# Altium schematic sheet ESP32_EDITED.SchDoc
size A
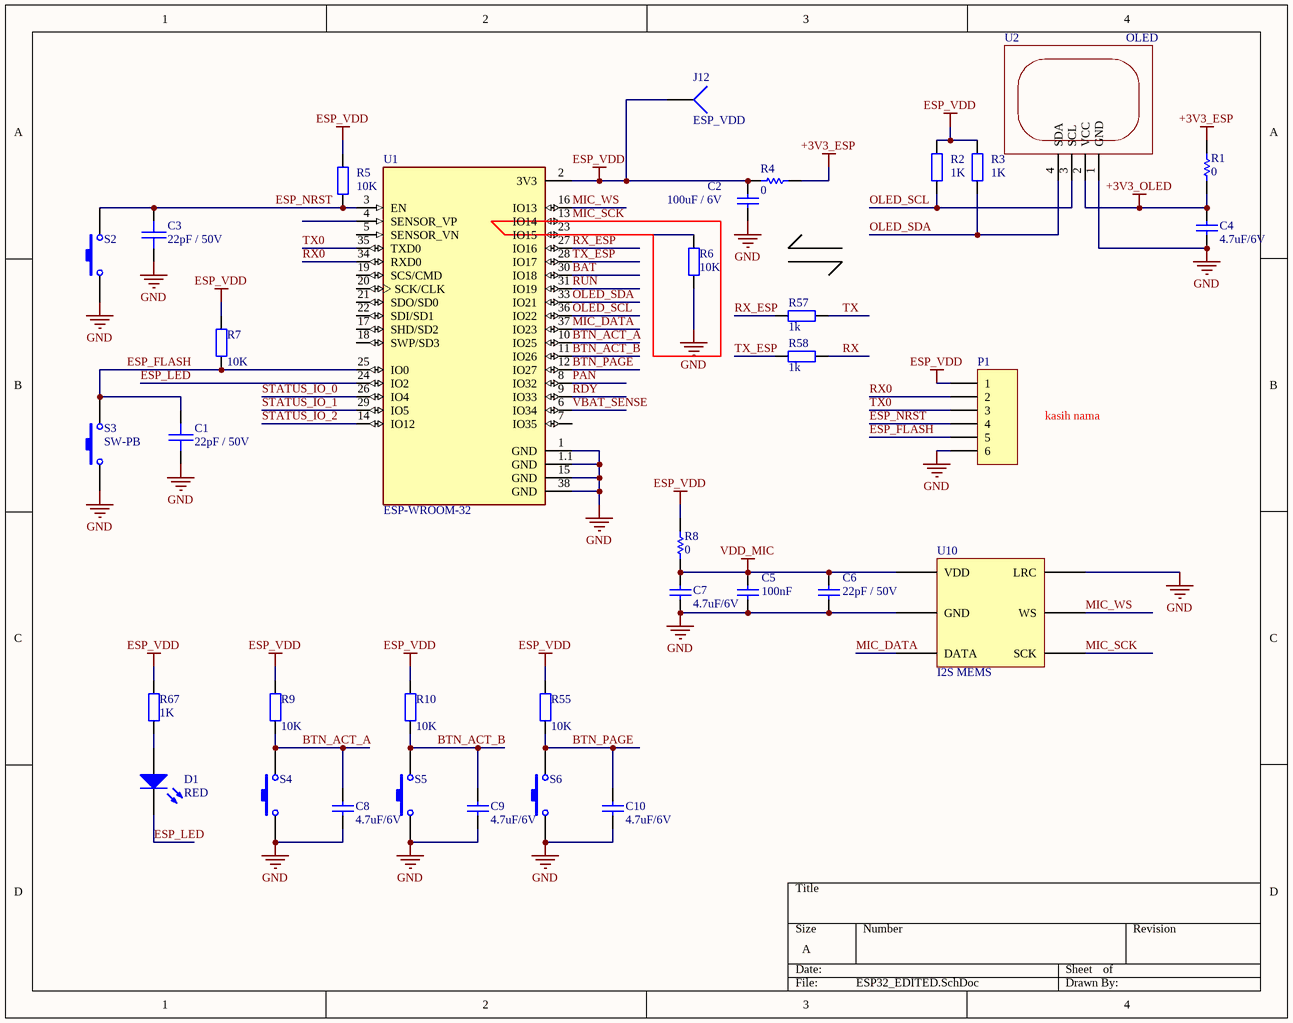
[diagram p0: ESP32_EDITED.SchDoc]

## Parts
C1  22pF / 50V  [CR2012-0805]
C2  100uF / 6V  [CR3216-1206]
C3  22pF / 50V  [CR2012-0805]
C4  4.7uF/6V  [CR2012-0805]
C5  100nF  [CR2012-0805]
C6  22pF / 50V  [CR2012-0805]
C7  4.7uF/6V  [CR2012-0805]
C8  4.7uF/6V  [CR2012-0805]
C9  4.7uF/6V  [CR2012-0805]
C10  4.7uF/6V  [CR2012-0805]
D1  RED  [LED1206]
J12  ESP_VDD  [PIN1]
P1  Header 6  [HDR1X6]  (value not drawn)
R1  0  [JP1_SMD]
R2  1K  [CR2012-0805]
R3  1K  [CR2012-0805]
R4  0  [JP1_SMD]
R5  10K  [CR2012-0805]
R6  10K  [CR2012-0805]
R7  10K  [CR2012-0805]
R8  0  [JP1_SMD]
R9  10K  [CR2012-0805]
R10  10K  [CR2012-0805]
R55  10K  [CR2012-0805]
R57  1k  [CR2012-0805]
R58  1k  [CR2012-0805]
R67  1K  [CR2012-0805]
S2  SW-PB  [pushbutton]  (value not drawn)
S3  SW-PB  [pushbutton]
S4  SW-PB  [pushbutton]  (value not drawn)
S5  SW-PB  [pushbutton]  (value not drawn)
S6  SW-PB  [pushbutton]  (value not drawn)
U1  ESP-WROOM-32  [MODULE_ESP-WROOM-32]
U2  OLED  [OLED_Display_1in6]
U10  I2S MEMS  [INMP441]

## Nets
+3V3_ESP: R1.2 R4.2
+3V3_OLED: C4.2 R1.1 U2.2(VCC)
ESP_VDD: C2.2 J12.1 P1.1 R2.2 R3.2 R4.1 R5.2 R7.2 R8.1 R9.2 R10.2 R55.2 R67.2 U1.2(3V3)
GND: C1.2 C2.1 C3.2 C4.1 C5.1 C6.1 C7.1 C8.1 C9.1 C10.1 P1.6 R6.2 S2.1 S3.1 S4.1 S5.1 S6.1 U1.1(GND) U1.1.1(GND) U1.15(GND) U1.38(GND) U2.1(GND) U10.3(LRC) U10.4(GND)
VDD_MIC: C5.2 C6.2 C7.2 R8.2 U10.5(VDD)
BAT: U1.30(IO18)
BTN_ACT_A: C8.2 R9.1 S4.2 U1.10(IO25)
BTN_ACT_B: C9.2 R10.1 S5.2 U1.11(IO26)
BTN_PAGE: C10.2 R55.1 S6.2 U1.12(IO27)
ESP_FLASH: C1.1 P1.5 R7.1 S3.2 U1.25(IO0)
ESP_LED: D1.K U1.24(IO2)
ESP_NRST: C3.1 P1.4 R5.1 S2.2 U1.3(EN)
MIC_DATA: U1.37(IO23) U10.6(DATA)
MIC_SCK: U1.13(IO14) U10.1(SCK)
MIC_WS: U1.16(IO13) U10.2(WS)
OLED_SCL: R2.1 U1.36(IO22) U2.3(SCL)
OLED_SDA: R3.1 U1.33(IO21) U2.4(SDA)
PAN: U1.8(IO32)
RDY: U1.9(IO33)
RUN: U1.31(IO19)
RX: R58.1
RX0: P1.2 U1.34(RXD0)
RX_ESP: R57.2 U1.27(IO16)
STATUS_IO_0: U1.26(IO4)
STATUS_IO_1: U1.29(IO5)
STATUS_IO_2: U1.14(IO12)
TX: R57.1
TX0: P1.3 U1.35(TXD0)
TX_ESP: R58.2 U1.28(IO17)
VBAT_SENSE: U1.6(IO34)
NetD1_A: D1.A R67.1
NetR6_1: R6.1 U1.23(IO15)

Not connected (* = marked no-connect by the designer): U1 4(SENSOR_VP) 5(SENSOR_VN) 7(IO35) 17(SHD/SD2) 18(SWP/SD3) 19(SCS/CMD) 20(SCK/CLK) 21(SDO/SD0) 22(SDI/SD1)

## Notes on the sheet
- kasih nama

## Library data of the parts
C1 C3 = SMT_C_0402: Surface mount capacitor 0402
C2 C5 C6 = Cap: Capacitor; Published: 8-Jun-2000; LatestRevisionDate: 17-Jul-2002; LatestRevisionNote: Re-released for DXP Platform.; PackageReference: RAD-0.3; Publisher: Altium Limited; PackageDescription: Radial Cap, Thru-Hole; 2 Leads; 0.3 in Pin Spacing
  C2: Value: 100uF / 6V
  C5: Value: 100nF
  C6: Value: 22pF / 50V
C4 C7-C10 = Cap Semi: Capacitor (Semiconductor SIM Model); Published: 8-Jun-2000; LatestRevisionDate: 29-May-2009; LatestRevisionNote: IPC-7351 Footprint Added.; PackageReference: C1206; Publisher: Altium Limited; PackageDescription: Chip Capacitor; Unit Price: 0.15; Value: 4.7uF/6V
D1 = LED2: Typical RED, GREEN, YELLOW, AMBER GaAs LED; Published: 8-Jun-2000; LatestRevisionDate: 17-Jul-2002; LatestRevisionNote: Re-released for DXP Platform.; PackageVersion: Feb-2002; PackageReference: 3.2X1.6X1.1; Publisher: Altium Limited; PackageDescription: SM LED; 2 Flat Leads
J12 = Socket: LatestRevisionDate: 17-Jul-2002; LatestRevisionNote: Re-released for DXP Platform.; Publisher: Altium Limited
P1 = Header 6: Header, 6-Pin; LatestRevisionDate: 17-Jul-2002; LatestRevisionNote: Re-released for DXP Platform.; Publisher: Altium Limited
R1 R4 R8 = Res Semi: Semiconductor Resistor; Published: 8-Jun-2000; LatestRevisionDate: 17-Jul-2002; LatestRevisionNote: Re-released for DXP Platform.; PackageReference: AXIAL-0.5; Publisher: Altium Limited; Unit Price: 0.15; Value: 0
R2 R3 R5-R7 R9 R10 R55 R57 R58 R67 = Res2: Resistor; Published: 8-Jun-2000; LatestRevisionDate: 17-Jul-2002; LatestRevisionNote: Re-released for DXP Platform.; PackageReference: AXIAL-0.4; Publisher: Altium Limited; PackageDescription: Axial Device, Thru-Hole; 2 Leads; 0.4 in Pin Spacing
  R2 R3 R67: Value: 1K
  R5-R7 R9 R10 R55: Value: 10K
  R57 R58: Value: 1k
S2 S4-S6 = SW-PB: Switch; Published: 24-Mar-1999; LatestRevisionDate: 17-Jul-2002; LatestRevisionNote: Re-released for DXP Platform.; PackageReference: SPST-2; Publisher: Altium Limited; PackageDescription: Switch; 2 Leads
S3 = pushbutton: Unit Price: 0.15
U1 = ESP-WROOM-32: WiFi 802.11b/g/n/d/e/i Transceiver Module 2.4GHz Surface Mount; MF: Olimex LTD; Value: *; SnapEDA_Link: https://www.snapeda.com/parts/ESP-WROOM-32/Olimex%20LTD/view-part/2311927/?ref=snap; MP: ESP-WROOM-32; Availability: Unavailable; Price: None; Package: Module Olimex LTD
U2 = OLED: I2C OLED 0.96"; Value: I2C OLED 0.96"
U10 = INMP441